# Altium schematic sheet E-07 CPU MISC.SchDoc: FRDM-IMX93
size 513 x 386 mm; DrawnBy: FORLINX; Organization: ORGANIZATION; Address1: ADDRESS 1; Address2: ADDRESS 2; Address3: ADDRESS 3; Address4: ADDRESS 4; Revision: -; ENG_APP_DATE: --/--/--; DSN_APP_DATE: --/--/--; CHK_APP_DATE: --/--/--; Classification: Public, Company Internal/Proprietary, Company Confidential,  Company Secret; Page Create Date: March  8, 1995; OrgName: NXP Semiconductor; FIUO: A; OrgAddr1: NO. 192 Liangjing Rd. Pudong New Area, ShangHai; Page Number: 7; PageTitle: CPU MISC; Page Size: C; Page Count: 23; Designer: FORLINX; RevCode: B1; Approver: NXP SE; Doc: SCH-94611 PDF: SPF-94611; DsnPath: T:\FILES\Designs\Single Board Computers\i.MX93-FRDM\Design Files\SCH-94611_B1.DSN; SchematicName: FRDM-i.MX 93 Development Board; PageName: E-07 CPU MISC; PageSize: C; TopSchematic: True
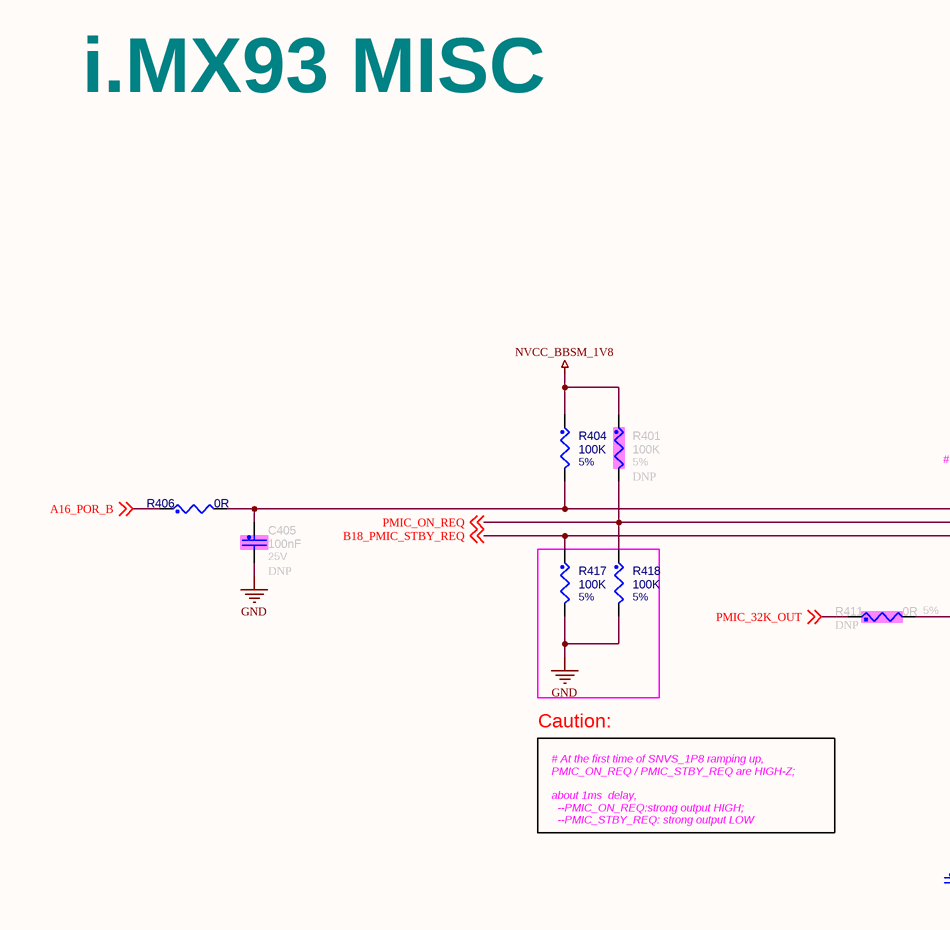
[diagram p0: E-07 CPU MISC.SchDoc, left]
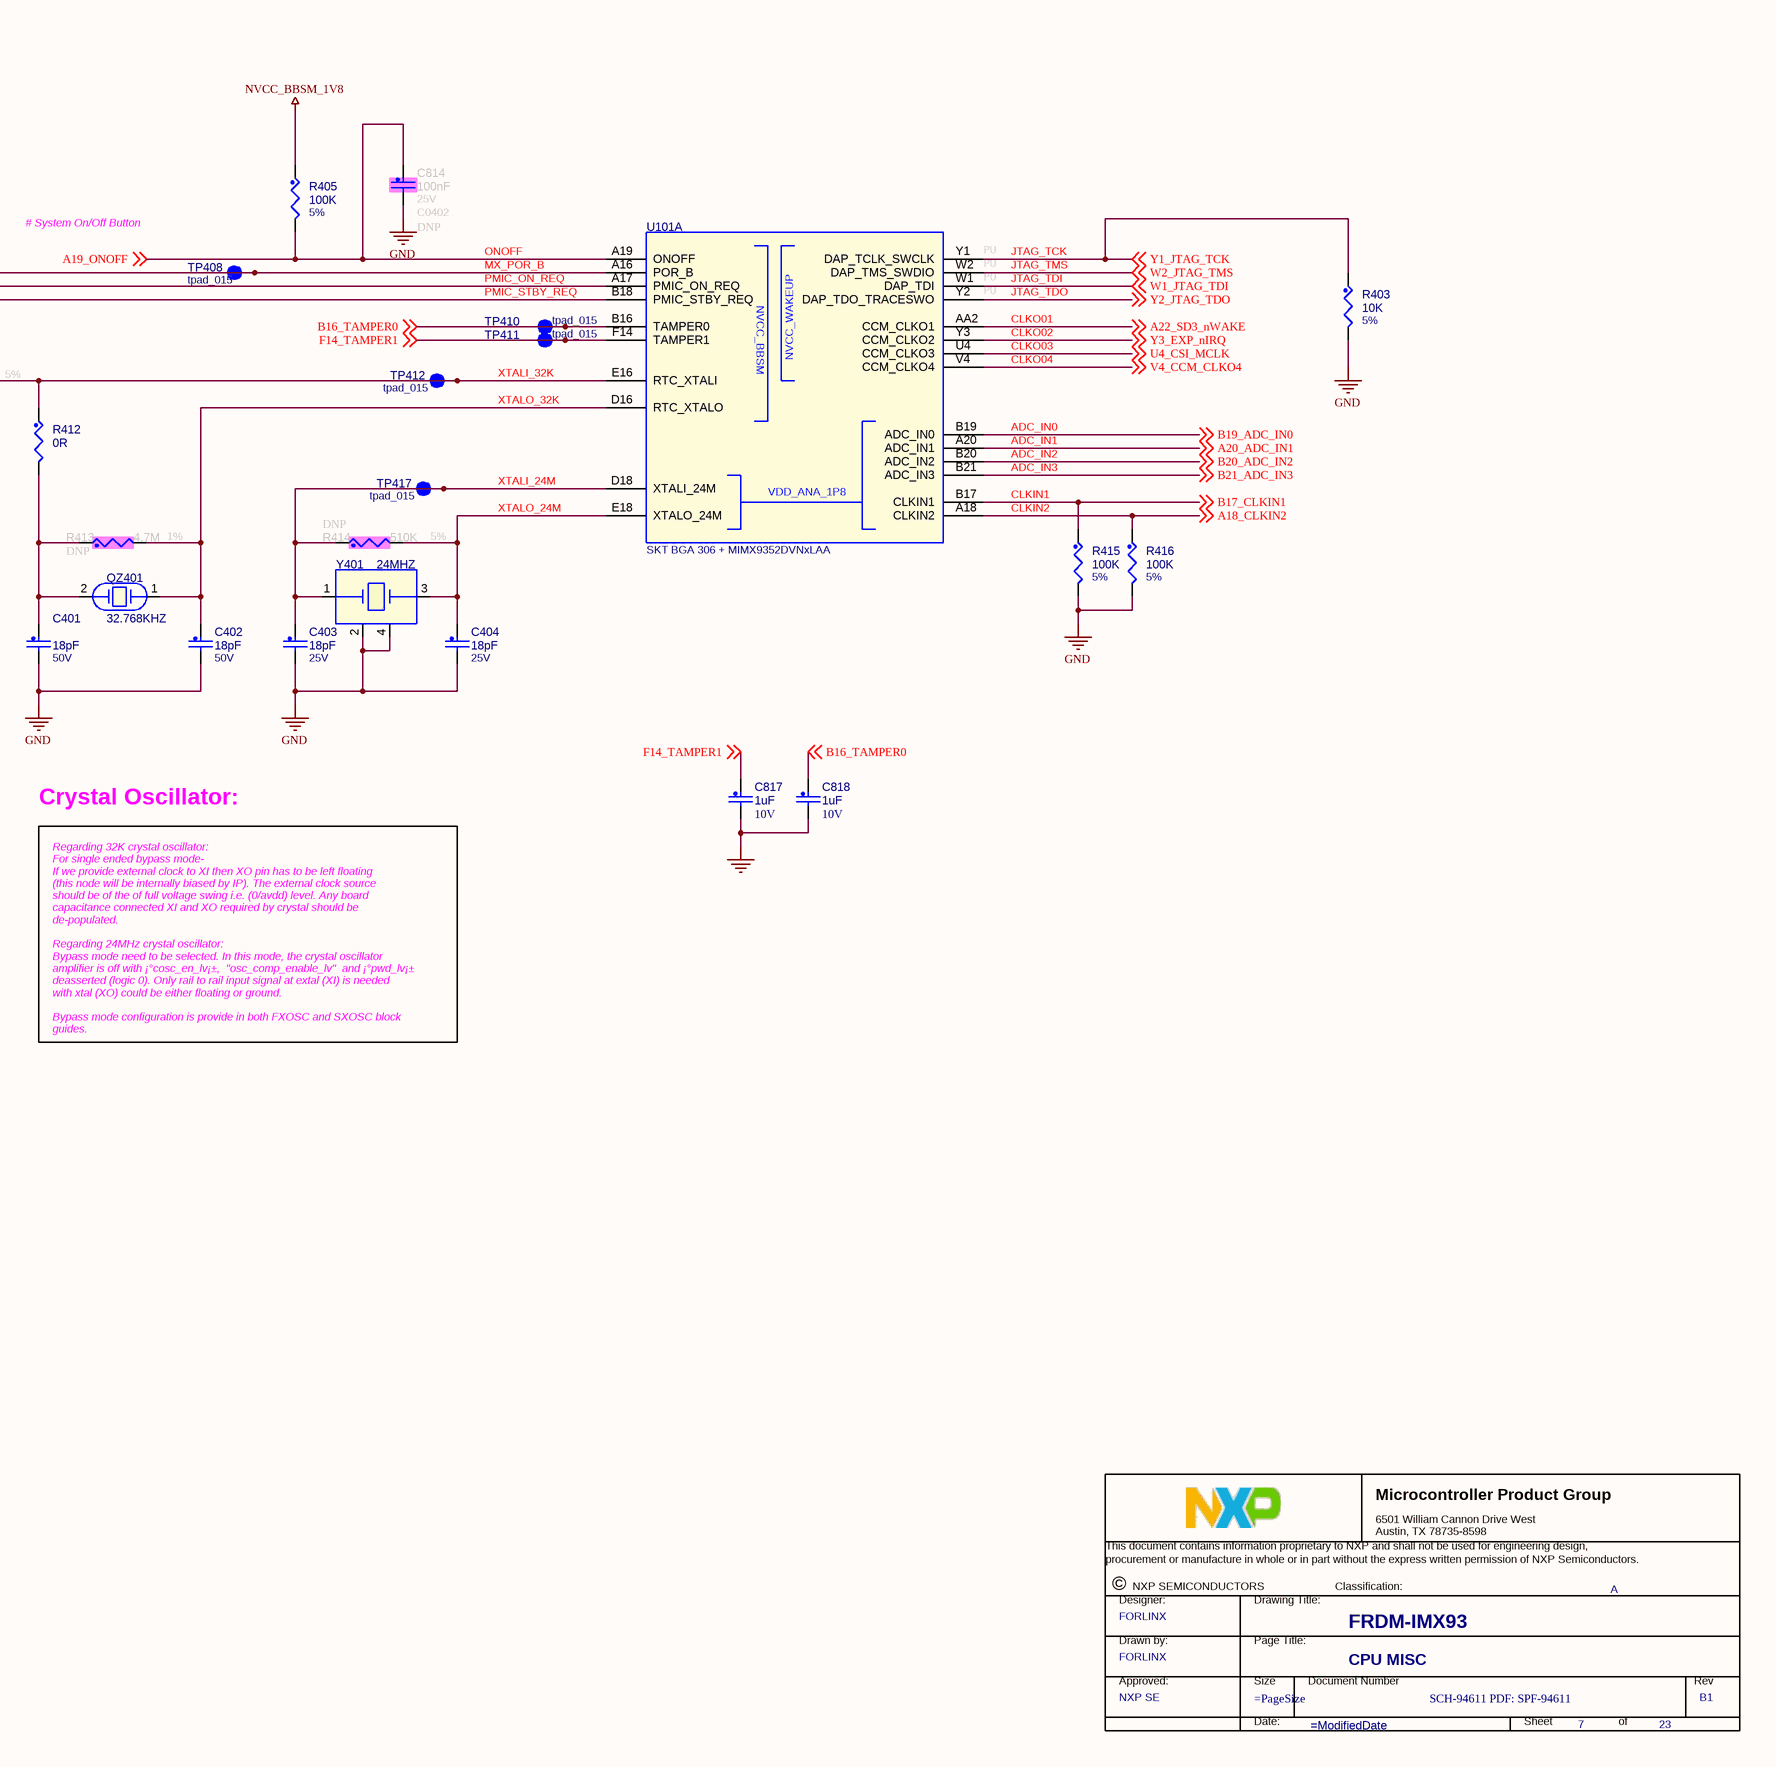
[diagram p1: E-07 CPU MISC.SchDoc, right]

## Parts
*  Title: FRDM-IMX93  RevCode: B1  PageTitle: CPU MISC  Page Number: 7  Page Count: 23  DrawnBy: FORLINX  Doc: SCH-94611 PDF: SPF-94611  Approver: NXP SE  FIUO: A  (graphical)
C401  18pF  VOLTAGE: 50V  [C0201]
C402  18pF  VOLTAGE: 50V  [C0201]
C403  18pF  VOLTAGE: 25V  [C0201]
C404  18pF  VOLTAGE: 25V  [C0201]
C405  100nF  ASSY_OPT: DNP  VOLTAGE: 25V  [C0402]
C814  100nF  ASSY_OPT: DNP  VOLTAGE: 25V  [C0402]
C817  1uF  VOLTAGE: 10V  [C0201]
C818  1uF  VOLTAGE: 10V  [C0201]
QZ401  32.768KHZ  [XTAL2-3P2X1P5-SM]
R401  100K  ASSY_OPT: DNP  Tolerance: 5%  [R0402]
R403  10K  Tolerance: 5%  [R0402]
R404  100K  Tolerance: 5%  [R0402]
R405  100K  Tolerance: 5%  [R0402]
R406  0R  [R0201]
R411  0R  ASSY_OPT: DNP  Tolerance: 5%  [R0201]
R412  0R  [R0201]
R413  4.7M  ASSY_OPT: DNP  Tolerance: 1%  [R0402]
R414  510K  ASSY_OPT: DNP  Tolerance: 5%  [R0402]
R415  100K  Tolerance: 5%  [R0402]
R416  100K  Tolerance: 5%  [R0402]
R417  100K  Tolerance: 5%  [R0402]
R418  100K  Tolerance: 5%  [R0402]
TP408  TPAD_015  [tpad_015]
TP410  TPAD_015  [tpad_015]
TP411  TPAD_015  [tpad_015]
TP412  TPAD_015  [tpad_015]
TP417  TPAD_015  [tpad_015]
U101  SKT BGA 306 + MIMX9352DVNxLAA  [skt_bga306_0p5_sq16p23_elast_nsp]  (part A of 6)
Y401  24MHZ  [xtlosc4_3p2x2p5mm_sm]

## Nets
GND: C401.2 C402.2 C403.2 C404.2 C405.2 C814.2 C817.2 C818.2 R403.2 R415.2 R416.2 R417.2 R418.2 Y401.2 Y401.4
NVCC_BBSM_1V8: R401.1 R404.1 R405.1
A16_POR_B: R406.1 ; off-sheet A16_POR_B
ADC_IN0: U101.B19(ADC_IN0) ; off-sheet B19_ADC_IN0  [also labelled B19_ADC_IN0]
ADC_IN1: U101.A20(ADC_IN1) ; off-sheet A20_ADC_IN1  [also labelled A20_ADC_IN1]
ADC_IN2: U101.B20(ADC_IN2) ; off-sheet B20_ADC_IN2  [also labelled B20_ADC_IN2]
ADC_IN3: U101.B21(ADC_IN3) ; off-sheet B21_ADC_IN3  [also labelled B21_ADC_IN3]
B16_TAMPER0: C818.1 TP410.1(Pin1) U101.B16(TAMPER0) ; off-sheet B16_TAMPER0
CLKIN1: R415.1 U101.B17(CLKIN1) ; off-sheet B17_CLKIN1  [also labelled B17_CLKIN1]
CLKIN2: R416.1 U101.A18(CLKIN2) ; off-sheet A18_CLKIN2  [also labelled A18_CLKIN2]
CLKO01: U101.AA2(CCM_CLKO1) ; off-sheet A22_SD3_nWAKE  [also labelled A22_SD3_nWAKE]
CLKO02: U101.Y3(CCM_CLKO2) ; off-sheet Y3_EXP_nIRQ  [also labelled Y3_EXP_nIRQ]
CLKO03: U101.U4(CCM_CLKO3) ; off-sheet U4_CSI_MCLK  [also labelled U4_CSI_MCLK]
CLKO04: U101.V4(CCM_CLKO4) ; off-sheet V4_CCM_CLKO4  [also labelled V4_CCM_CLKO4]
F14_TAMPER1: C817.1 TP411.1(Pin1) U101.F14(TAMPER1) ; off-sheet F14_TAMPER1
JTAG_TCK: R403.1 U101.Y1(DAP_TCLK_SWCLK) ; off-sheet Y1_JTAG_TCK  [also labelled Y1_JTAG_TCK]
JTAG_TDI: U101.W1(DAP_TDI) ; off-sheet W1_JTAG_TDI  [also labelled W1_JTAG_TDI]
JTAG_TDO: U101.Y2(DAP_TDO_TRACESWO) ; off-sheet Y2_JTAG_TDO  [also labelled Y2_JTAG_TDO]
JTAG_TMS: U101.W2(DAP_TMS_SWDIO) ; off-sheet W2_JTAG_TMS  [also labelled W2_JTAG_TMS]
MX_POR_B: C405.1 R404.2 R406.2 TP408.1(Pin1) U101.A16(POR_B)
ONOFF: C814.1 R405.2 U101.A19(ONOFF) ; off-sheet A19_ONOFF  [also labelled A19_ONOFF]
PMIC_32K_OUT: R411.1 ; off-sheet PMIC_32K_OUT
PMIC_ON_REQ: R401.2 R418.1 U101.A17(PMIC_ON_REQ) ; off-sheet PMIC_ON_REQ
PMIC_STBY_REQ: R417.1 U101.B18(PMIC_STBY_REQ) ; off-sheet B18_PMIC_STBY_REQ  [also labelled B18_PMIC_STBY_REQ]
XTALI_24M: C403.1 R414.1 TP417.1(Pin1) U101.D18(XTALI_24M) Y401.1
XTALI_32K: R411.2 R412.1 TP412.1(Pin1) U101.E16(RTC_XTALI)
XTALO_24M: C404.1 R414.2 U101.E18(XTALO_24M) Y401.3
XTALO_32K: C402.1 QZ401.1 R413.2 U101.D16(RTC_XTALO)
NetC401_1: C401.1 QZ401.2 R412.2 R413.1

## Notes on the sheet
- i.MX93 MISC
- # System On/Off Button
- (near U101) PU
- Caution:
- # At the first time of SNVS_1P8 ramping up,
  PMIC_ON_REQ / PMIC_STBY_REQ are HIGH-Z;
  about 1ms  delay,
  --PMIC_ON_REQ:strong output HIGH;
  --PMIC_STBY_REQ: strong output LOW
- Crystal Oscillator:
- Regarding 32K crystal oscillator:
  For single ended bypass mode-
  If we provide external clock to XI then XO pin has to be left floating
  (this node will be internally biased by IP). The external clock source
  should be of the of full voltage swing i.e. (0/avdd) level. Any board
  capacitance connected XI and XO required by crystal should be
  de-populated.
  Regarding 24MHz crystal oscillator:
  Bypass mode need to be selected. In this mode, the crystal oscillator
  amplifier is off with ¡°cosc_en_lv¡±,  "osc_comp_enable_lv"  and ¡°pwd_lv¡±
  deasserted (logic 0). Only rail to rail input signal at extal (XI) is needed
  with xtal (XO) could be either floating or ground.
  Bypass mode configuration is provide in both FXOSC and SXOSC block
  guides.
- DWG. NO.
- REV.
- SHT.
- REVISION
- DESCRIPTION
- DATE
- APPROVED
- ENG:
- APPROVALS
- quilter.ai <http://quilter.ai>
- DSN:
- CHK:
- REFERENCE DOCUMENTS
- TITLE
- PROJECT
- BOM:
- FAB DWG:
- PCB DWG:
- ASSY DWG:
- SIZE
- FILE NAME
- C
- DWG NO.
- SHEET
- OF
- REV
- (in symbol MIMX9352DVNxLAA, part A) NVCC_BBSM; NVCC_WAKEUP; VDD_ANA_1P8
- (in symbol TitleBlock_MCPG) Microcontroller Product Group; 6501 William Cannon Drive West / Austin, TX 78735-8598; This document contains information proprietary to NXP and shall not be used for engineering design,; procurement or manufacture in whole or in part without the express written permission of NXP Semiconductors.; ©; NXP SEMICONDUCTORS; Classification:; Designer:; Drawing Title:; Drawn by:; Page Title:; Approved:; Size; Document Number; Rev; Date:; Sheet; of

## Library data of the parts
* = TitleBlock_MCPG: Classification: Public, Company Internal/Proprietary, Company Confidential,  Company Secret; OrgAddr1: NO. 192 Liangjing Rd. Pudong New Area, ShangHai; OrgName: NXP Semiconductor; Page Size: =PageSize; Page Create Date: March  8, 1995; Designer: FORLINX; Page Modify Date: =ModifiedDate
C401 = CAP_NP: 0201,18pF,50V,+/-5%,NPO; Part Reference: C401; CLASS: DISCRETE; Tolerance: 5%; MFG_NAME01: FENGHUA; MFG_PN01: 0201CG180J500NT; CAD_APPROVED: Yes; FPLIST: CC0201,CC0201_HD,0201_CC; Value: 18pF; ROHS: Yes; HEIGHT: 0.33MM; Package Size: 0201; Package Type: &#966;180mm Paper taping; PCB Footprint: C0201
C402 = CAP_NP: 0201,18pF,50V,+/-5%,NPO; Part Reference: C402; CLASS: DISCRETE; FPLIST: CC0201,CC0201_HD,0201_CC; CAD_APPROVED: Yes; MFG_PN01: 0201CG180J500NT; MFG_NAME01: FENGHUA; Tolerance: 5%; Value: 18pF; HEIGHT: 0.33MM; ROHS: Yes; Package Size: 0201; Package Type: &#966;180mm Paper taping; PCB Footprint: C0201
C403 = CAP_NP: 0201,18pF,50V,+/-5%,NPO; Part Reference: C403; CLASS: DISCRETE; Tolerance: 5%; MFG_NAME01: FENGHUA; MFG_PN01: 0201CG180J500NT; CAD_APPROVED: Yes; FPLIST: CC0201,CC0201_HD,0201_CC; Value: 18pF; ROHS: Yes; HEIGHT: 0.33MM; PCB Footprint: C0201
C404 = CAP_NP: 0201,18pF,50V,+/-5%,NPO; Part Reference: C404; CLASS: DISCRETE; Tolerance: 5%; MFG_NAME01: FENGHUA; MFG_PN01: 0201CG180J500NT; CAD_APPROVED: Yes; FPLIST: CC0201,CC0201_HD,0201_CC; Value: 18pF; ROHS: Yes; HEIGHT: 0.33MM; PCB Footprint: C0201
C405 = CAP_NP: 0402,100nF,50V,+/-10%,X5R; Part Reference: C405; CLASS: DISCRETE; FPLIST: CC0402_25,CC0402_HD,0402_CC; CAD_APPROVED: Yes; MFG_PN01: 0402X104K500NT; MFG_NAME01: FENGHUA; Tolerance: 10%; Value: 100nF; HEIGHT: 0.55MM; ROHS: Yes; Package Size: 0402; PCB Footprint: C0402
C814 = CAP_NP: 0402,100nF,50V,+/-10%,X5R; Part Reference: C814; CLASS: DISCRETE; Tolerance: 10%; MFG_NAME01: FENGHUA; MFG_PN01: 0402X104K500NT; CAD_APPROVED: Yes; FPLIST: CC0402_25,CC0402_HD,0402_CC; Value: 100nF; Package Size: 0402; ROHS: Yes; HEIGHT: 0.55MM; PCB Footprint: C0402
C817 = CAP_NP: 0201,1uF,10V,+/-20%,X5R; Part Reference: C817; CLASS: DISCRETE; FPLIST: CC0201,CC0201_HD,0201_CC,cc_0201_cir; CAD_APPROVED: Yes; MFG_PN01: CL03A105MP3NSNC; MFG_NAME01: SAMSUNG; Tolerance: 10%; Temp Range: -55¡ãC to 85¡ãC; Value: 1uF; Package Type: SMD/SMT; Package Size: 0201 (0603 Metric); HEIGHT: 0.35MM; ROHS: Yes; PCB Footprint: C0201
C818 = CAP_NP: 0201,1uF,10V,+/-20%,X5R; Part Reference: C818; CLASS: DISCRETE; FPLIST: CC0201,CC0201_HD,0201_CC,cc_0201_cir; CAD_APPROVED: Yes; MFG_PN01: CL03A105MP3NSNC; MFG_NAME01: SAMSUNG; Tolerance: 10%; Temp Range: -55¡ãC to 85¡ãC; Value: 1uF; Package Type: SMD/SMT; Package Size: 0201 (0603 Metric); HEIGHT: 0.35MM; ROHS: Yes; PCB Footprint: C0201
QZ401 = XTAL: Crystal,32.768KHZ,3.2*1.5mm,+/-20ppm,12.5PF,S999-311,-40~85+C; Part Reference: QZ401; CLASS: IC; MFG_NAME01: Dongxin Hengke; MFG_PN01: KK32768g33C; CAD_APPROVED: Yes; Value: 32.768KHZ; ROHS: Yes; HEIGHT: 0.9MM; PCB Footprint: XTAL2-3P2X1P5-SM
R401 = RES: 0402,100K,+/-1%; Part Reference: R401; CLASS: DISCRETE; Temp Range: -55C to +155C; VOLTAGE: 50V; MFG_NAME01: FENGHUA; MFG_PN01: RC-02K1003FT; CAD_APPROVED: Yes; FPLIST: RC0402_25,RC0402_HD,0402_CC; Value: 100K; ROHS: Yes; HEIGHT: 0.40 MM; PCB Footprint: R0402
R403 = RES: 0402,10K,+/-1%; Part Reference: R403; CLASS: DISCRETE; MFG_NAME01: FENGHUA; MFG_PN01: RC-02W1002FT; CAD_APPROVED: Yes; FPLIST: RC0402_25,RC0402_HD,0402_CC; Value: 10K; ROHS: Yes; HEIGHT: 0.4 MM; PCB Footprint: R0402
R404 = RES: 0402,100K,+/-1%; Part Reference: R404; CLASS: DISCRETE; Temp Range: -55C to +155C; VOLTAGE: 50V; MFG_NAME01: FENGHUA; MFG_PN01: RC-02K1003FT; CAD_APPROVED: Yes; FPLIST: RC0402_25,RC0402_HD,0402_CC; Value: 100K; ROHS: Yes; HEIGHT: 0.40 MM; PCB Footprint: R0402
R405 = RES: 0402,100K,+/-1%; Part Reference: R405; CLASS: DISCRETE; FPLIST: RC0402_25,RC0402_HD,0402_CC; CAD_APPROVED: Yes; MFG_PN01: RC-02K1003FT; MFG_NAME01: FENGHUA; VOLTAGE: 50V; Temp Range: -55C to +155C; Value: 100K; HEIGHT: 0.40 MM; ROHS: Yes; PCB Footprint: R0402
R406 = RES: 0201,0Ohm,+/-5%; Part Reference: R406; CLASS: DISCRETE; FPLIST: RC0201,0201_CC,RC0201_X2; CAD_APPROVED: Yes; MFG_PN01: RC-01000JT; MFG_NAME01: FENGHUA; Value: 0R; HEIGHT: 0.30 MM; ROHS: Yes; PCB Footprint: R0201
R411 = RES: 0201,0Ohm,+/-5%; Part Reference: R411; CLASS: DISCRETE; FPLIST: RC0201,0201_CC,RC0201_X2; CAD_APPROVED: Yes; MFG_PN01: RC-01000JT; MFG_NAME01: FENGHUA; Value: 0R; HEIGHT: 0.30 MM; ROHS: Yes; PCB Footprint: R0201
R412 = RES: 0201,0Ohm,+/-5%; Part Reference: R412; CLASS: DISCRETE; FPLIST: RC0201,0201_CC,RC0201_X2; CAD_APPROVED: Yes; MFG_PN01: RC-01000JT; MFG_NAME01: FENGHUA; Value: 0R; HEIGHT: 0.30 MM; ROHS: Yes; PCB Footprint: R0201
R413 = RES: 0402,4.7M,+/-5%; Part Reference: R413; CLASS: DISCRETE; FPLIST: RC0402_25,RC0402_HD,0402_CC; CAD_APPROVED: Yes; VOLTAGE: 50V; Temp Range: -55¡ãC ~ 155¡ãC; MFG_NAME01: FENGHUA; MFG_PN01: RC-02U475JT; Value: 4.7M; HEIGHT: 0.40 MM; ROHS: Yes; PCB Footprint: R0402
R414 = RES: 0402,510K,+/-5%; Part Reference: R414; CLASS: DISCRETE; MFG_NAME01: FENGHUA; MFG_PN01: RC-02K514JT; CAD_APPROVED: Yes; FPLIST: RC0402_25,RC0402_HD,0402_CC; Value: 510K; ROHS: Yes; HEIGHT: 0.4 MM; PCB Footprint: R0402
R415 = RES: 0402,100K,+/-1%; Part Reference: R415; CLASS: DISCRETE; FPLIST: RC0402_25,RC0402_HD,0402_CC; CAD_APPROVED: Yes; MFG_PN01: RC-02K1003FT; MFG_NAME01: FENGHUA; VOLTAGE: 50V; Temp Range: -55C to +155C; Value: 100K; HEIGHT: 0.40 MM; ROHS: Yes; PCB Footprint: R0402
R416 = RES: 0402,100K,+/-1%; Part Reference: R416; CLASS: DISCRETE; FPLIST: RC0402_25,RC0402_HD,0402_CC; CAD_APPROVED: Yes; MFG_PN01: RC-02K1003FT; MFG_NAME01: FENGHUA; VOLTAGE: 50V; Temp Range: -55C to +155C; Value: 100K; HEIGHT: 0.40 MM; ROHS: Yes; PCB Footprint: R0402
R417 = RES: 0402,100K,+/-1%; Part Reference: R417; CLASS: DISCRETE; FPLIST: RC0402_25,RC0402_HD,0402_CC; CAD_APPROVED: Yes; MFG_PN01: RC-02K1003FT; MFG_NAME01: FENGHUA; VOLTAGE: 50V; Temp Range: -55C to +155C; Value: 100K; HEIGHT: 0.40 MM; ROHS: Yes; PCB Footprint: R0402
R418 = RES: 0402,100K,+/-1%; Part Reference: R418; CLASS: DISCRETE; FPLIST: RC0402_25,RC0402_HD,0402_CC; CAD_APPROVED: Yes; MFG_PN01: RC-02K1003FT; MFG_NAME01: FENGHUA; VOLTAGE: 50V; Temp Range: -55C to +155C; Value: 100K; HEIGHT: 0.40 MM; ROHS: Yes; PCB Footprint: R0402
TP408 = TESTLOOP: no part to order; Part Reference: TP408; CLASS: IO; ASSY_OPT: DNP; CAD_APPROVED: Yes; MFG_PN01: NOT A COMPONENT; HEIGHT: 0.1MM; ROHS: Yes; MFG_NAME01: NOT A COMPONENT; PCB Footprint: tpad_015
TP410 = TESTLOOP: no part to order; Part Reference: TP410; CLASS: IO; ASSY_OPT: DNP; MFG_NAME01: NOT A COMPONENT; CAD_APPROVED: Yes; MFG_PN01: NOT A COMPONENT; ROHS: Yes; HEIGHT: 0.1MM; PCB Footprint: tpad_015
TP411 = TESTLOOP: no part to order; Part Reference: TP411; CLASS: IO; ASSY_OPT: DNP; CAD_APPROVED: Yes; MFG_PN01: NOT A COMPONENT; HEIGHT: 0.1MM; ROHS: Yes; MFG_NAME01: NOT A COMPONENT; PCB Footprint: tpad_015
TP412 = TESTLOOP: no part to order; Part Reference: TP412; CLASS: IO; ASSY_OPT: DNP; CAD_APPROVED: Yes; MFG_PN01: NOT A COMPONENT; HEIGHT: 0.1MM; ROHS: Yes; MFG_NAME01: NOT A COMPONENT; PCB Footprint: tpad_015
TP417 = TESTLOOP: no part to order; Part Reference: TP417; CLASS: IO; ASSY_OPT: DNP; MFG_NAME01: NOT A COMPONENT; CAD_APPROVED: Yes; MFG_PN01: NOT A COMPONENT; ROHS: Yes; HEIGHT: 0.1MM; PCB Footprint: tpad_015
U101 = MIMX9352DVNxLAA: MIMX9352CVVXMAB,-40~105+C,11*11mm,0.5mm pitch,FCBGA,A,306pin,1.7GHz; Part Reference: U101; CLASS: IC; MFG_NAME01: NXP SEMICONDUCTORS; CAD_APPROVED: Yes; FPLIST: skt_bga306_0p5_sq16p23_elast,skt_bga306_0p5_sq16p23_elast_nsp; Value: SKT BGA 306 + MIMX9352DVNxLAA; MFG_PN01: MIMX9352DVNxLAA; ROHS: Yes; HEIGHT: 10.03MM; PCB Footprint: skt_bga306_0p5_sq16p23_elast_nsp
Y401 = XTAL_13: Crystal,24MHZ,4P,3.2*2.5mm,+/-20ppm,12pF; Part Reference: Y401; CLASS: IC; MFG_NAME01: Dongxin Hengke; MFG_PN01: SE24000G33D; CAD_APPROVED: Yes; Value: 24MHZ; ROHS: Yes; HEIGHT: 0.60MM; PCB Footprint: xtlosc4_3p2x2p5mm_sm